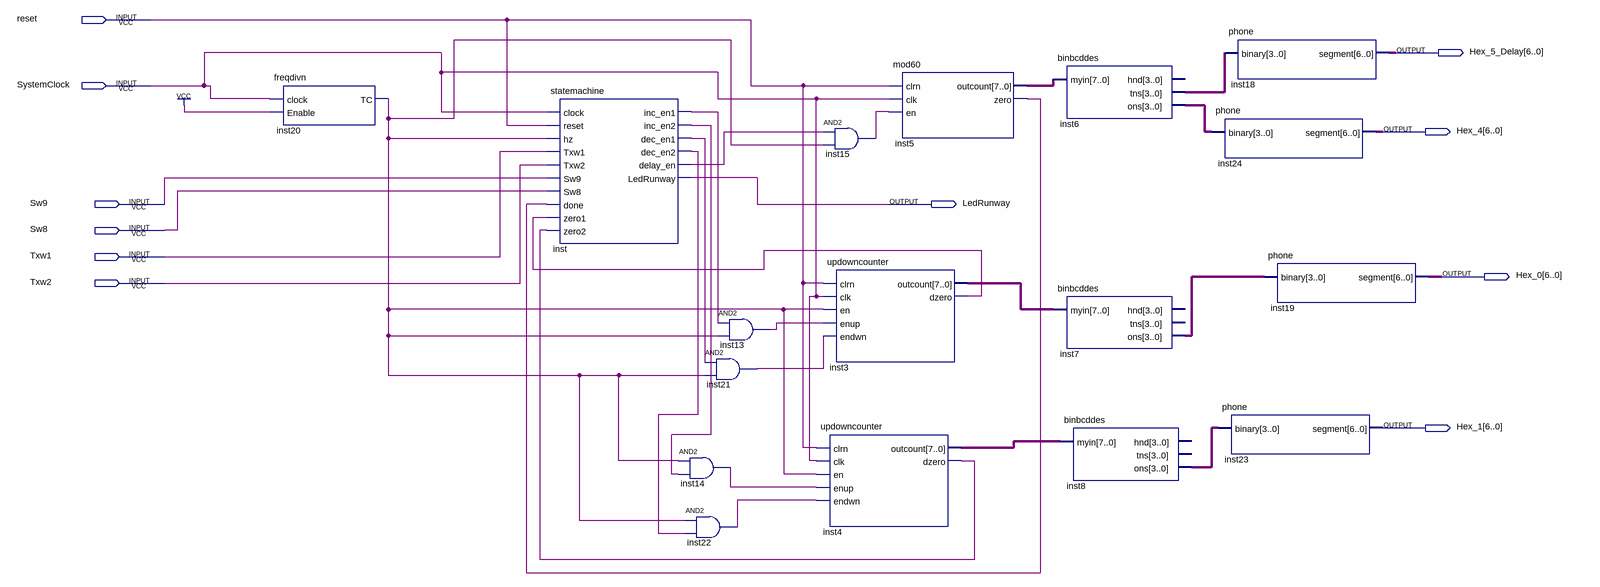
[diagram p0: schematic sheet]
// Quartus schematic mproject.bdf as structural Verilog: 17 symbols, 11 pins
module mproject (
  input  reset,
  input  SystemClock,
  input  Sw9,
  input  Sw8,
  input  Txw1,
  input  Txw2,
  output [6:0] Hex_5_Delay,
  output [6:0] Hex_4,
  output LedRunway,
  output [6:0] Hex_0,
  output [6:0] Hex_1
);

  wire inst3_dzero, inst4_dzero, inst5_zero, inst13_out, inst14_out, inst15_out, inst20_tc, inst21_out,
       inst22_out, inst_dec_en1, inst_dec_en2, inst_delay_en, inst_inc_en1, inst_inc_en2;
  wire [3:0] inst6_ons, inst6_tns, inst7_ons, inst8_ons;
  wire [7:0] inst3_outcount, inst4_outcount, inst5_outcount;

  freqdivn inst20 (.clock(SystemClock), .Enable(1'b1), .TC(inst20_tc));
  statemachine inst (
    .clock(SystemClock), .reset(reset), .hz(inst20_tc), .Txw1(Txw1), .Txw2(Txw2), .Sw9(Sw9), .Sw8(Sw8),
    .done(inst5_zero), .zero1(inst3_dzero), .zero2(inst4_dzero), .inc_en1(inst_inc_en1),
    .inc_en2(inst_inc_en2), .dec_en1(inst_dec_en1), .dec_en2(inst_dec_en2), .delay_en(inst_delay_en),
    .LedRunway(LedRunway));
  and inst21 (inst21_out, inst_dec_en1, inst20_tc);
  and inst14 (inst14_out, inst20_tc, inst_inc_en2);
  and inst22 (inst22_out, inst20_tc, inst_dec_en2);
  and inst13 (inst13_out, inst_inc_en1, inst20_tc);
  updowncounter inst4 (
    .clrn(reset), .clk(SystemClock), .en(inst20_tc), .enup(inst14_out), .endwn(inst22_out),
    .outcount(inst4_outcount), .dzero(inst4_dzero));
  and inst15 (inst15_out, inst_delay_en, inst20_tc);
  updowncounter inst3 (
    .clrn(reset), .clk(SystemClock), .en(inst20_tc), .enup(inst13_out), .endwn(inst21_out),
    .outcount(inst3_outcount), .dzero(inst3_dzero));
  mod60 inst5 (.clrn(reset), .clk(SystemClock), .en(inst15_out), .outcount(inst5_outcount), .zero(inst5_zero));
  binbcddes inst6 (.myin(inst5_outcount), .tns(inst6_tns), .ons(inst6_ons));  // open: hnd
  binbcddes inst7 (.myin(inst3_outcount), .ons(inst7_ons));  // open: hnd, tns
  binbcddes inst8 (.myin(inst4_outcount), .ons(inst8_ons));  // open: hnd, tns
  phone inst18 (.binary(inst6_tns), .segment(Hex_5_Delay));
  phone inst24 (.binary(inst6_ons), .segment(Hex_4));
  phone inst23 (.binary(inst8_ons), .segment(Hex_1));
  phone inst19 (.binary(inst7_ons), .segment(Hex_0));
endmodule
